# EAGLE design usb-geiger (EAGLE 6.4)
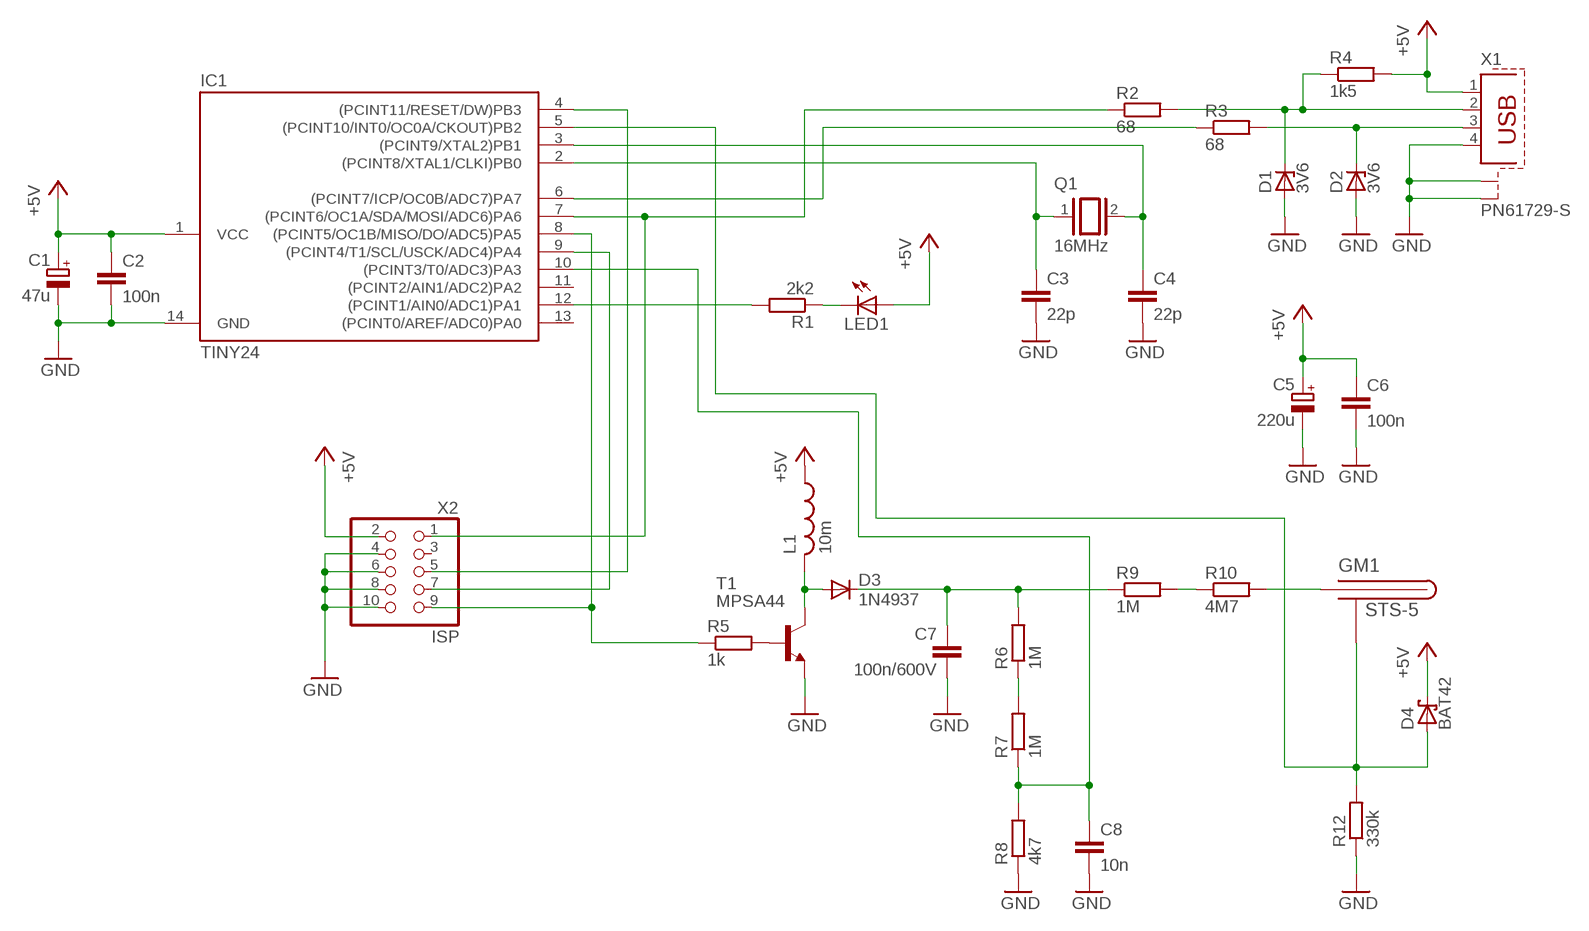
[diagram p0: schematic, sheet 1]

## Parts
C1  47u  CPOL-EUE2.5-6  [E2,5-6]
C2  100n  C-EU050-025X075  [C050-025X075]
C3  22p  C-EU025-025X050  [C025-025X050]
C4  22p  C-EU025-025X050  [C025-025X050]
C5  220u  CPOL-EUE5-10.5  [E5-10,5]
C6  100n  C-EU050-025X075  [C050-025X075]
C7  100n/600V  C-EU225-113X268  [C225-113X268]
C8  10n  C-EU050-025X075  [C050-025X075]
D1  3V6  ZENER-DIODEDO34-7  [DO34Z7]
D2  3V6  ZENER-DIODEDO34-7  [DO34Z7]
D3  1N4937  1N4933  [DO41-10]
D4  BAT42  [DO35-10]
GM1  STS-5  [STS-5]
IC1  TINY24  TINY24/44/84-PU  [DIL14]
L1  10m  L-US0207/5V  [0207/5V]
LED1  LED3MM  [LED3MM]
Q1  16MHz  XTAL/S  [QS]
R1  2k2  R-EU_0207/10  [0207/10]
R2  68  R-EU_0207/10  [0207/10]
R3  68  R-EU_0207/10  [0207/10]
R4  1k5  R-EU_0207/10  [0207/10]
R5  1k  R-EU_0207/10  [0207/10]
R6  1M  R-EU_0207/10  [0207/10]
R7  1M  R-EU_0207/10  [0207/10]
R8  4k7  R-EU_0207/10  [0207/10]
R9  1M  R-EU_0207/10  [0207/10]
R10  4M7  R-EU_0207/10  [0207/10]
R12  330k  R-EU_0207/10  [0207/10]
T1  MPSA44  [TO92-EBC]
X1  PN61729-S  [PN61729-S]
X2  PINHD-2X5  [2X05]

## Nets
+5V: C1.+ C2.1 C5.+ C6.1 D4.C IC1.1(VCC) L1.1 LED1.A R4.2 X1.1 X2.2
GND: C1.- C2.2 C3.2 C4.2 C5.- C6.2 C7.2 C8.2 D1.A D2.A IC1.14(GND) R8.1 R12.1 T1.E X1.4 X1.S1 X1.S2 X2.4 X2.6 X2.8 X2.10
N$1: R6.1 R7.2
N$2: D3.A L1.2 T1.C
N$3: R5.2 T1.B
N$4: C7.1 D3.C R6.2 R9.1
N$5: R9.2 R10.1
N$6: GM1.PLUS1(PLUS) GM1.PLUS2(PLUS) R10.2
N$7: C8.1 IC1.10((PCINT3/T0/ADC3)PA3) R7.1 R8.2
N$8: IC1.6((PCINT7/ICP/OC0B/ADC7)PA7) R3.1
N$9: D4.A GM1.MINUS1(MINUS) GM1.MINUS2(MINUS) IC1.5((PCINT10/INT0/OC0A/CKOUT)PB2) R12.2
N$10: IC1.8((PCINT5/OC1B/MISO/DO/ADC5)PA5) R5.1 X2.9
N$12: IC1.7((PCINT6/OC1A/SDA/MOSI/ADC6)PA6) R2.1 X2.1
N$13: IC1.4((PCINT11/RESET/DW)PB3) X2.5
N$15: IC1.9((PCINT4/T1/SCL/USCK/ADC4)PA4) X2.7
N$16: D1.C R2.2 R4.1 X1.2
N$17: D2.C R3.2 X1.3
N$18: C4.1 IC1.3((PCINT9/XTAL2)PB1) Q1.2
N$19: C3.1 IC1.2((PCINT8/XTAL1/CLKI)PB0) Q1.1
N$20: IC1.12((PCINT1/AIN0/ADC1)PA1) R1.2
N$21: LED1.K(C) R1.1
Unconnected: IC1.11((PCINT2/AIN1/ADC2)PA2) IC1.13((PCINT0/AREF/ADC0)PA0) X2.3

## Notes on the sheet
- ISP

## Library data of the parts
C1 C5 = rcl:CPOL-EU: POLARIZED CAPACITOR, European symbol
C2-C4 C6-C8 = rcl:C-EU: CAPACITOR, European symbol
D1 D2 = diode:ZENER-DIODE: Z-Diode
D3 = diode:1N4933: DIODE fast recovery rectifier, 1A
D4 = diode:BAT42: DIODE barrier diode
GM1 = geiger:STS-5: Russian STS-5 (originally CTC-5) Geiger counter tube. Parameters: Working Voltage 360 - 440V Initial Voltage 280 - 330V Plateau Length 80V Plateau Slope 0.125% / 1V Innerent counter background (cps) 0.45 Pulses/sec Pulse Sensitivity 24 Pulses/sec Interelectrode Capacitance 7pF Load Resistance 5 - 10 MOhms Working Temperature Range -40 +50 С Length 110mm Diameter 9mm
IC1 = avr-7:TINY24/44/84
L1 = rcl:L-US: INDUCTOR, American symbol
LED1 = led:LED: LED OSRAM: - CHIPLED LG R971, LG N971, LY N971, LG Q971, LY Q971, LO R971, LY R971 LH N974, LH R974 LS Q976, LO Q976, LY Q976 LO Q996 - Hyper CHIPLED LW Q18S LB Q993, LB Q99A, LB R99A - SideLED LS A670, LO A670, LY A670, LG A670, LP A670 LB A673, LV A673, LT A673, LW A673 LH A674 LY A675 LS A676, LA A676, LO A676, LY A676, LW A676 LS A679, LY A679, LG A679 - Hyper Micro SIDELED® LS Y876, LA Y876, LO Y876, LY Y876 LT Y87S - SmartLED LW L88C, LW L88S LB L89C, LB L89S, LG L890 LS L89K, LO L89K, LY L89K LS L896, LA L896, LO L896, LY L896 - TOPLED LS T670, LO T670, LY T670, LG T670, LP T670 LSG T670, LSP T670, LSY T670, LOP T670, LYG T670 LG T671, LOG T671, LSG T671 LB T673, LV T673, LT T673, LW T673 LH T674 LS T676, LA T676, LO T676, LY T676, LB T676, LH T676, LSB T676, LW T676 LB T67C, LV T67C, LT T67C, LS T67K, LO T67K, LY T67K, LW E67C LS E67B, LA E67B, LO E67B, LY E67B, LB E67C, LV E67C, LT E67C LW T67C LS T679, LY T679, LG T679 LS T770, LO T770, LY T770, LG T770, LP T770 LB T773, LV T773, LT T773, LW T773 LH T774 LS E675, LA E675, LY E675, LS T675 LS T776, LA T776, LO T776, LY T776, LB T776 LHGB T686 LT T68C, LB T68C - Hyper Mini TOPLED® LB M676 - Mini TOPLED Santana® LG M470 LS M47K, LO M47K, LY M47K Source: http://www.osram.convergy.de LUXEON: - LUMILED® LXK2-PW12-R00, LXK2-PW12-S00, LXK2-PW14-U00, LXK2-PW14-V00 LXK2-PM12-R00, LXK2-PM12-S00, LXK2-PM14-U00 LXK2-PE12-Q00, LXK2-PE12-R00, LXK2-PE12-S00, LXK2-PE14-T00, LXK2-PE14-U00 LXK2-PB12-K00, LXK2-PB12-L00, LXK2-PB12-M00, LXK2-PB14-N00, LXK2-PB14-P00, LXK2-PB14-Q00 LXK2-PR12-L00, LXK2-PR12-M00, LXK2-PR14-Q00, LXK2-PR14-R00 LXK2-PD12-Q00, LXK2-PD12-R00, LXK2-PD12-S00 LXK2-PH12-R00, LXK2-PH12-S00 LXK2-PL12-P00, LXK2-PL12-Q00, LXK2-PL12-R00 Source: www.luxeon.com KINGBRIGHT: KA-3528ASYC Source: www.kingbright.com
Q1 = special:XTAL/S: CRYSTAL
R1-R10 R12 = rcl:R-EU_: RESISTOR, European symbol
T1 = geiger:MPSA44: Small Signal High Voltage Transistor
X1 = con-berg:PN61729-S: BERG USB connector; OC_FARNELL: unknown; OC_NEWARK: unknown
X2 = pinhead:PINHD-2X5: PIN HEADER

## Board
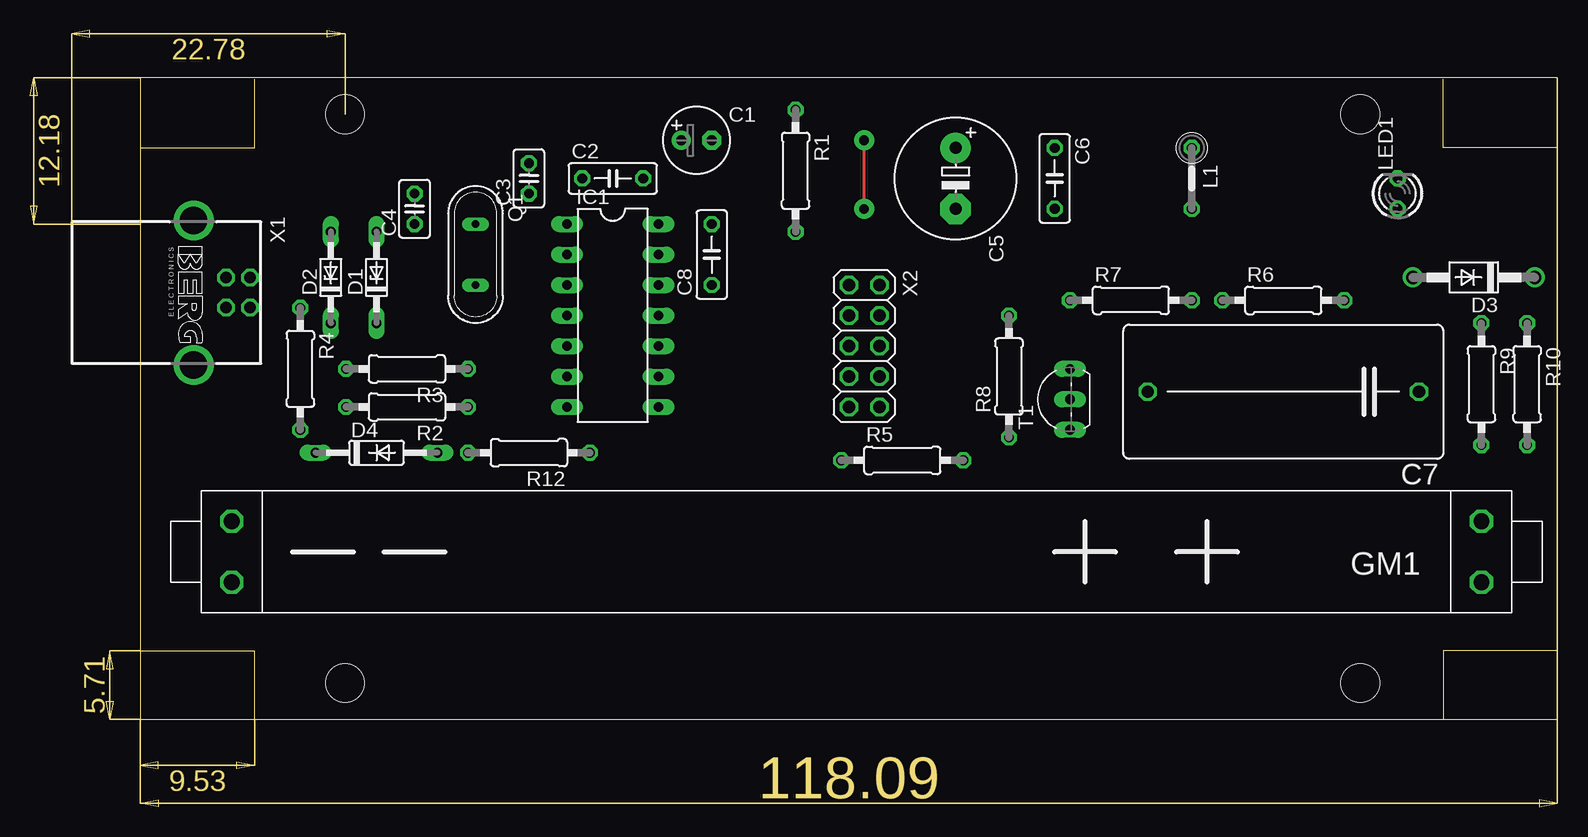
[diagram p1: board, top side]
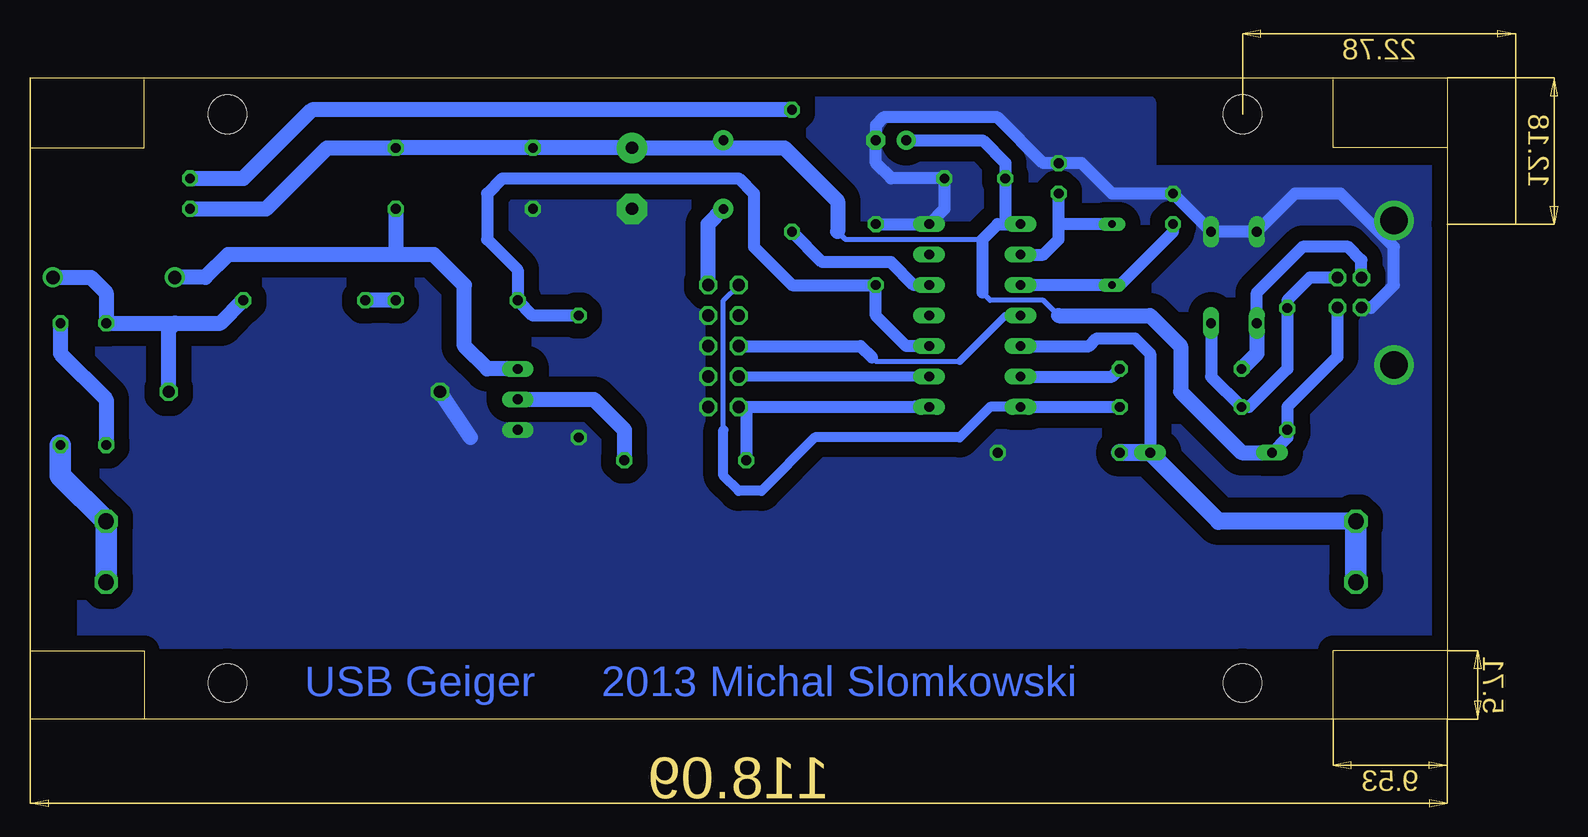
[diagram p2: board, bottom side, seen from below]

Size 118.11 x 53.46 mm. Coordinates in mm from the lower left corner, seen from the top.
Outline: 9.53,0 0,0 0,5.71
Outline: 9.53,0 108.58,0
Outline: 108.58,0 118.09,0 118.09,53.46 0,53.46 0,47.62
Outline: 0,47.62 0,5.71
Outline: 0,47.62 9.53,47.62 9.53,53.34
Outline: 118.11,47.62 108.58,47.62 108.58,53.34
Outline: 9.53,0 9.53,5.71 0,5.71
Outline: 118.11,5.71 108.58,5.71 108.58,0
Copper layers (1*16): Top 0.035mm / dielectric 1.5mm / Bottom 0.035mm
Design rules "default": minimum track width 10mil, minimum drill 24mil, track to track 8mil, track to pad 8mil, pad to pad 8mil, via to via 8mil, smd to smd 8mil, copper to edge 40mil, drill to drill 8mil, minimum pad ring 10mil, minimum via ring 8mil, stop-mask expansion 4mil, vias tented up to drill 0mil, thermal gap 10mil
Holes 3.2 mm at 101.66,50.43 17.06,50.43 17.06,3.03 101.66,3.03

### Footprints (pad centres in the part's own frame; a part is rotated, then mirrored left to right if it is on the bottom)
E2,5-6 = drill 0.813 pad 1.6: + -1.27,0 | drill 0.813 pad 1.6 octagon: - 1.27,0
C050-025X075 = drill 0.813 octagon: 1 -2.54,0; 2 2.54,0
C025-025X050 = drill 0.813 octagon: 1 -1.27,0; 2 1.27,0
E5-10,5 = drill 1.016 pad 2.54: + -2.54,0 | drill 1.016 pad 2.54 octagon: - 2.54,0
C225-113X268 = drill 1.016 octagon: 1 -11.303,0; 2 11.303,0
DO34Z7 = drill 0.813 long: A 3.81,0; C -3.81,0
DO41-10 = drill 1.118: A 5.08,0; C -5.08,0
DO35-10 = drill 0.813 long: A 5.08,0; C -5.08,0
STS-5 = drill 1.3 octagon: MINUS1 66.04,0; MINUS2 66.04,-5.08; PLUS1 -38.1,0; PLUS2 -38.1,-5.08
DIL14 = drill 0.813 long: 1 -7.62,-3.81; 2 -5.08,-3.81; 3 -2.54,-3.81; 4 0,-3.81; 5 2.54,-3.81; 6 5.08,-3.81; 7 7.62,-3.81; 8 7.62,3.81; 9 5.08,3.81; 10 2.54,3.81; 11 0,3.81; 12 -2.54,3.81; 13 -5.08,3.81; 14 -7.62,3.81
0207/5V = drill 0.813 octagon: 1 -2.54,0; 2 2.54,0
LED3MM = drill 0.813 octagon: A -1.27,0; K 1.27,0
QS = drill 0.61 long: 1 -2.54,0; 2 2.54,0
0207/10 = drill 0.813 octagon: 1 -5.08,0; 2 5.08,0
TO92-EBC = drill 0.813 long: B 0,-1.27; C 2.54,-1.27; E -2.54,-1.27
PN61729-S = drill 0.95 octagon: 1 1.25,4.71; 2 -1.25,4.71; 3 -1.25,2.71; 4 1.25,2.71 | drill 2.3 pad 2.9: S1 -6.02,0; S2 6.02,0
2X05 = drill 1.016 octagon: 1 -5.08,-1.27; 2 -5.08,1.27; 3 -2.54,-1.27; 4 -2.54,1.27; 5 0,-1.27; 6 0,1.27; 7 2.54,-1.27; 8 2.54,1.27; 9 5.08,-1.27; 10 5.08,1.27

### Placement (x,y rotation side)
C1  46.36,48.26 0 top
C2  39.37,45.08 0 top
C3  32.39,45.08 90 top
C4  22.86,42.54 90 top
C5  67.94,45.08 270 top
C6  76.2,45.08 270 top
C7  95.25,27.3 180 top
C8  47.62,38.73 90 top
D1  19.68,36.83 90 top
D2  15.88,36.83 90 top
D3  111.12,36.83 180 top
D4  19.68,22.23 0 top
GM1  73.66,11.43 180 top
IC1  39.37,33.65 270 top
L1  87.63,45.08 270 top
LED1  104.77,43.81 90 top
Q1  27.94,38.73 270 top
R1  54.61,45.72 270 top
R2  22.22,26.04 180 top
R3  22.22,29.21 180 top
R4  13.34,29.21 270 top
R5  63.5,21.59 0 top
R6  95.25,34.92 0 top
R7  82.55,34.92 0 top
R8  72.39,28.57 90 top
R9  111.76,27.94 270 top
R10  115.57,27.94 270 top
R12  32.39,22.23 180 top
T1  76.2,26.67 90 top
X1  4.45,35.56 270 top
X2  60.33,31.11 270 top

### Tracks (layer width: path | path; a pad name or v marks a point on that pad's centre or on a via)
+5V  (via drill 0.8 pad 1.68)
  Top 0.254: v60.33,42.54 v60.33,48.26
  Bottom 0.406: 32.39,33.65 33.66,34.92 38.1,34.92 38.73,35.56 | 38.73,40 50.16,40 50.8,40.64
  Bottom 1.016: 38.73,35.56 38.73,40 37.47,41.27 36.83,41.27 | 36.83,41.27 IC1.1 | 36.83,41.27 C2.1 36.83,46.35 38.73,48.26 C1.+ | D4.C 13.34,23.5 R4.2 13.34,26.04 9.15,30.21 X1.1
  Bottom 1.27: X2.2 61.59,41.27 v60.33,42.54 | v60.33,48.26 60.96,47.62 | 60.96,47.62 55.25,47.62 50.8,43.18 50.8,40.64 | 60.96,47.62 C5.+ C6.1 L1.1 93.34,47.62 98.42,42.54 LED1.A | 32.39,33.65 24.76,33.65 22.22,31.11 22.22,27.3 17.14,22.23 D4.C
GND
  Bottom 1.016: C8.2 IC1.14 41.91,42.54 C2.2 46.36,45.08 47.62,46.35 C1.- 47.62,49.53 46.99,50.16 37.47,50.16 33.66,46.35 C3.2 30.48,46.35 27.94,43.81 C4.2 D1.A D2.A 12.7,43.81 8.89,43.81 4.45,39.37 4.45,36.2 6.35,34.29 7.13,34.29 X1.4
  Bottom 1.27: 81.41,23.5 C7.2
  pour Bottom (isolate 1.27, no thermals): 113.66,6.35 113.66,51.43 24.76,51.43 24.76,45.72 0.64,45.72 0.64,6.35
N$1
  Bottom 1.27: R7.2 R6.1
N$2
  Bottom 1.27: L1.2 87.63,38.73 | 87.63,38.73 101.6,38.73 103.5,36.83 D3.A | 87.63,38.73 84.45,38.73 81.91,36.2 81.91,31.11 80.01,29.21 T1.C
N$3
  Bottom 1.27: T1.B 71.12,26.67 68.58,24.13 R5.2
N$4
  Bottom 1.27: D3.C 113.03,36.83 111.76,35.56 R9.1 106.05,33.02 | 106.05,33.02 102.23,33.02 R6.2 | C7.1 106.55,32.51 106.05,33.02
N$5
  Bottom 1.27: R10.1 115.57,30.48 111.76,26.67 R9.2
N$6
  Bottom 1.778: R10.2 115.57,20.32 GM1.PLUS2 GM1.PLUS1
N$7
  Bottom 1.016: R8.2 76.2,33.65 R7.1 77.47,37.46 80.01,40 80.01,43.81 78.74,45.08 59.05,45.08 57.79,43.81 57.79,39.37 54.61,36.2 C8.1 47.62,33.65 45.09,31.11 IC1.10
N$8
  Bottom 1.016: IC1.6 27.94,28.57 R3.1
N$9
  Bottom 1.016: IC1.5 29.84,31.11 29.21,31.75 26.04,31.75 24.76,30.48 D4.A
  Bottom 1.422: GM1.MINUS2 19.05,16.51 D4.A R12.2
  Bottom 1.778: GM1.MINUS1 GM1.MINUS2
N$10
  Bottom 1.016: 44.45,26.04 IC1.8 58.42,26.04 | 58.42,26.04 R5.1 | X2.9 58.42,26.04
N$12
  Bottom 0.406: 60.33,24.13 60.33,34.92 X2.1
  Bottom 0.813: IC1.7 38.1,26.04 40.64,23.5 52.71,23.5 57.15,19.05 59.05,19.05 60.33,20.32 60.33,24.13
  Bottom 1.016: IC1.7 R2.1
N$13
  Bottom 0.406: 40.64,29.84 47.62,29.84 47.94,30.16
  Bottom 0.61: 40.64,29.84 36.83,33.65 IC1.4
  Bottom 1.016: X2.5 48.9,31.11 47.94,30.16
N$15
  Bottom 0.813: IC1.9 X2.7
N$16
  Bottom 1.016: D1.C 19.68,28.57 R2.2 16.51,26.04 13.34,29.21 R4.1 13.34,34.92 11.45,36.81 X1.2
N$17
  Bottom 1.016: X1.3 7.16,38.27 8.26,39.37 12.06,39.37 15.88,35.56 D2.C
  Bottom 1.27: D2.C 15.88,30.48 R3.2
N$18
  Bottom 1.016: IC1.3 Q1.2 27.3,36.2 22.86,40.64 C4.1
N$19
  Bottom 1.016: Q1.1 32.39,41.27 | 32.39,41.27 C3.1 | IC1.2 33.66,38.73 32.39,40 32.39,41.27
N$20
  Bottom 1.016: IC1.12 44.45,36.2 46.36,38.1 52.07,38.1 R1.2
N$21
  Bottom 1.27: R1.1 94.61,50.8 100.33,45.08 LED1.K
N$22  (via drill 1)
  other vias: 17.06,50.43
N$25  (via drill 1)
  other vias: 17.06,3.03
N$26  (via drill 1)
  other vias: 101.66,50.43
N$27  (via drill 1)
  other vias: 101.66,3.03

### Text on the board
Bottom: 2013 Michal Slomkowski | USB Geiger